# Altium schematic sheet Delay_latch_stage.SchDoc
size A4; SheetNumber: 4; SheetTotal: 5
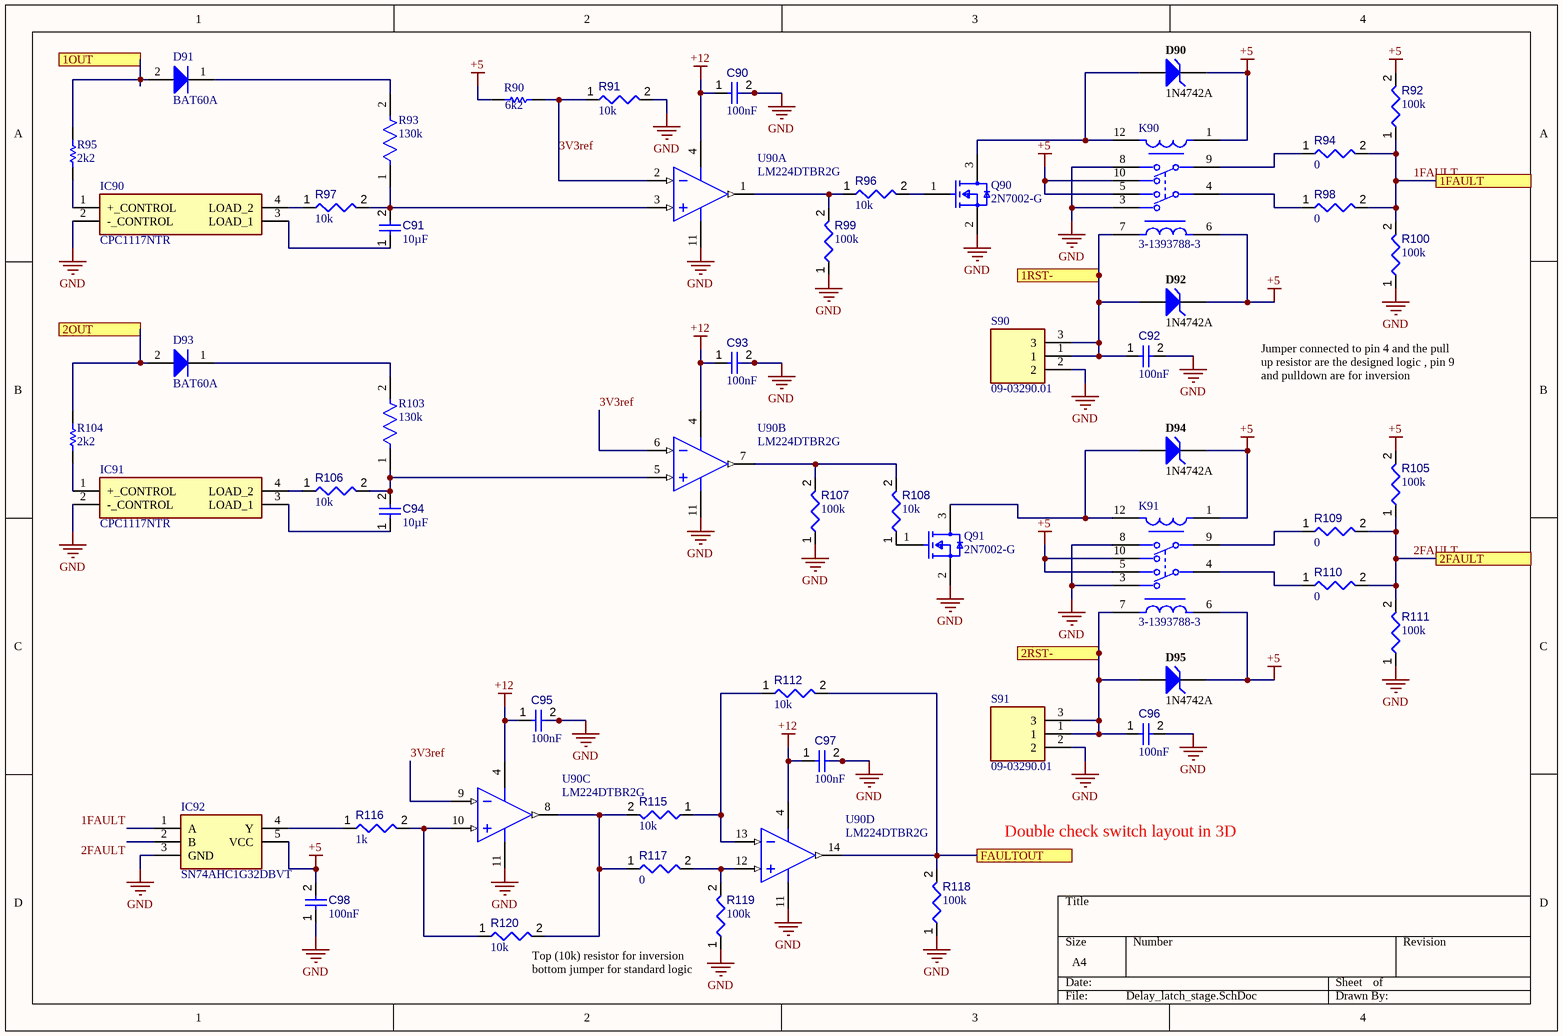
[diagram p0: Delay_latch_stage.SchDoc]

## Parts
C90  value 100nF  [CAPC1608X90X40NL10T20]  (hidden comment: Capacitor 100 nF +/-10% 50 V 0603)
C91  value 10µF  [CAPC0603(1608)100_L]  (hidden comment: Capacitor 10µF +/-20% 10V 0603)
C92  value 100nF  [CAPC1608X90X40NL10T20]  (hidden comment: Capacitor 100 nF +/-10% 50 V 0603)
C93  value 100nF  [CAPC1608X90X40NL10T20]  (hidden comment: Capacitor 100 nF +/-10% 50 V 0603)
C94  value 10µF  [CAPC0603(1608)100_L]  (hidden comment: Capacitor 10µF +/-20% 10V 0603)
C95  value 100nF  [CAPC1608X90X40NL10T20]  (hidden comment: Capacitor 100 nF +/-10% 50 V 0603)
C96  value 100nF  [CAPC1608X90X40NL10T20]  (hidden comment: Capacitor 100 nF +/-10% 50 V 0603)
C97  value 100nF  [CAPC1608X90X40NL10T20]  (hidden comment: Capacitor 100 nF +/-10% 50 V 0603)
C98  value 100nF  [CAPC1608X90X40NL10T20]  (hidden comment: Capacitor 100 nF +/-10% 50 V 0603)
D90  1N4742A  [FAIR-DO-41-2_V]
D91  BAT60A  [INF-SOD323_V]
D92  1N4742A  [FAIR-DO-41-2_V]
D93  BAT60A  [INF-SOD323_V]
D94  1N4742A  [FAIR-DO-41-2_V]
D95  1N4742A  [FAIR-DO-41-2_V]
IC90  CPC1117NTR  [SOP254P610X216-4N]
IC91  CPC1117NTR  [SOP254P610X216-4N]
IC92  SN74AHC1G32DBVT  [SOT95P280X145-5N]
K90  3-1393788-3  [FP-3-1393788-3-MFG]
K91  3-1393788-3  [FP-3-1393788-3-MFG]
Q90  2N7002-G  [FP-2N7002-G-IPC_C]
Q91  2N7002-G  [FP-2N7002-G-IPC_C]
R90  6k2  [RESC1609X50X30ML10T20]
R91  value 10k  [RESC1608X55X25ML10T15]  (hidden comment: Resistor 10k +/-1% 0603 100 mW)
R92  value 100k  [RESC1608X55X25ML10T15]  (hidden comment: Resistor 100k +/-1% 0603 100 mW)
R93  130k  [FP-CRCW0603-e3-IPC_C]
R94  value 0  [RESC0603(1608)_L]  (hidden comment: 0R3J)
R95  2k2  [RESC1608X55X25LL10T15]
R96  value 10k  [RESC1608X55X25ML10T15]  (hidden comment: Resistor 10k +/-1% 0603 100 mW)
R97  value 10k  [RESC1608X55X25ML10T15]  (hidden comment: Resistor 10k +/-1% 0603 100 mW)
R98  value 0  [RESC0603(1608)_L]  (hidden comment: 0R3J)
R99  value 100k  [RESC1608X55X25ML10T15]  (hidden comment: Resistor 100k +/-1% 0603 100 mW)
R100  value 100k  [RESC1608X55X25ML10T15]  (hidden comment: Resistor 100k +/-1% 0603 100 mW)
R103  130k  [FP-CRCW0603-e3-IPC_C]
R104  2k2  [RESC1608X55X25LL10T15]
R105  value 100k  [RESC1608X55X25ML10T15]  (hidden comment: Resistor 100k +/-1% 0603 100 mW)
R106  value 10k  [RESC1608X55X25ML10T15]  (hidden comment: Resistor 10k +/-1% 0603 100 mW)
R107  value 100k  [RESC1608X55X25ML10T15]  (hidden comment: Resistor 100k +/-1% 0603 100 mW)
R108  value 10k  [RESC1608X55X25ML10T15]  (hidden comment: Resistor 10k +/-1% 0603 100 mW)
R109  value 0  [RESC0603(1608)_L]  (hidden comment: 0R3J)
R110  value 0  [RESC0603(1608)_L]  (hidden comment: 0R3J)
R111  value 100k  [RESC1608X55X25ML10T15]  (hidden comment: Resistor 100k +/-1% 0603 100 mW)
R112  value 10k  [RESC1608X55X25ML10T15]  (hidden comment: Resistor 10k +/-1% 0603 100 mW)
R115  value 10k  [RESC1608X55X25ML10T15]  (hidden comment: Resistor 10k +/-1% 0603 100 mW)
R116  value 1k  [RESC1608X55X25ML10T15]  (hidden comment: Resistor 1k +/-1% 0603 100 mW)
R117  value 0  [RESC0603(1608)_L]  (hidden comment: 0R3J)
R118  value 100k  [RESC1608X55X25ML10T15]  (hidden comment: Resistor 100k +/-1% 0603 100 mW)
R119  value 100k  [RESC1608X55X25ML10T15]  (hidden comment: Resistor 100k +/-1% 0603 100 mW)
R120  value 10k  [RESC1608X55X25ML10T15]  (hidden comment: Resistor 10k +/-1% 0603 100 mW)
S90  09-03290.01  [09.03290.01]
S91  09-03290.01  [09.03290.01]
U90  LM224DTBR2G  [ONSC-TSSOP-14-948G-01_V]  (parts A,B,C,D of 4)

## Ports
1FAULT, 1OUT, 1RST-, 2FAULT, 2OUT, 2RST-, FAULTOUT

## Nets
+5: C98.2 D90.2(K) D92.2(K) D94.2(K) D95.2(K) IC92.5(VCC) K90.1(set+/reset-) K90.5 K90.6(reset+/set-) K90.10 K91.1(set+/reset-) K91.5 K91.6(reset+/set-) K91.10 R90.1 R92.2 R105.2
+12: C90.1 C93.1 C95.1 C97.1 U90.4(VCC)
GND: C90.2 C92.2 C93.2 C95.2 C96.2 C97.2 C98.1 IC90.2(-_CONTROL) IC91.2(-_CONTROL) IC92.3(GND) K90.3 K90.8 K91.3 K91.8 Q90.2(SOURCE) Q91.2(SOURCE) R91.2 R99.1 R100.1 R107.1 R111.1 R118.1 R119.1 S90.2 S91.2 U90.11(VEE/GND)
1FAULT: IC92.1(A) R92.1 R94.2 R98.2 R100.2 ; port 1FAULT
1OUT: D91.2(A) R95.2 ; port 1OUT
1RST-: C92.1 D92.1(A) K90.7(reset-/set+) S90.1 S90.3 ; port 1RST-
2FAULT: IC92.2(B) R105.1 R109.2 R110.2 R111.2 ; port 2FAULT
2OUT: D93.2(A) R104.2 ; port 2OUT
2RST-: C96.1 D95.1(A) K91.7(reset-/set+) S91.1 S91.3 ; port 2RST-
3V3ref: R90.2 R91.1 U90.2(IN1-) U90.6(IN2-) U90.9(IN3-)
FAULTOUT: R112.2 R118.2 U90.14(OUT4) ; port FAULTOUT
NetC91_1: C91.1 IC90.3(LOAD_1)
NetC91_2: C91.2 R93.1 R97.2 U90.3(IN1+)
NetC94_1: C94.1 IC91.3(LOAD_1)
NetC94_2: C94.2 R103.1 R106.2 U90.5(IN2+)
NetD90_1: D90.1(A) K90.12(set-/reset+) Q90.3(DRAIN)
NetD91_1: D91.1(K) R93.2
NetD93_1: D93.1(K) R103.2
NetD94_1: D94.1(A) K91.12(set-/reset+) Q91.3(DRAIN)
NetIC90_1: IC90.1(+_CONTROL) R95.1
NetIC90_4: IC90.4(LOAD_2) R97.1
NetIC91_1: IC91.1(+_CONTROL) R104.1
NetIC91_4: IC91.4(LOAD_2) R106.1
NetIC92_4: IC92.4(Y) R116.1
NetK90_4: K90.4 R98.1
NetK90_9: K90.9 R94.1
NetK91_4: K91.4 R110.1
NetK91_9: K91.9 R109.1
NetQ90_1: Q90.1(GATE) R96.2
NetQ91_1: Q91.1(GATE) R108.1
NetR96_1: R96.1 R99.2 U90.1(OUT1)
NetR107_2: R107.2 R108.2 U90.7(OUT2)
NetR112_1: R112.1 R115.1 U90.13(IN4-)
NetR115_2: R115.2 R117.1 R120.2 U90.8(OUT3)
NetR116_2: R116.2 R120.1 U90.10(IN3+)
NetR117_2: R117.2 R119.2 U90.12(IN4+)

## Notes on the sheet
- Jumper connected to pin 4 and the pull up resistor are the designed logic , pin 9 and pulldown are for inversion
- Double check switch layout in 3D
- (near R120) Top (10k) resistor for inversion bottom jumper for standard logic

## Library data of the parts
C90 C92 C93 C95-C98 = CMP-001-00017-6: Chip Capacitor, 100 nF, +/- 10%, 50 V, 0603 (1608 Metric); Voltage Rating: 50V; Capacitor Type: Ceramic; Tolerance: 10%; Mounting Technology: SM; Max Operating Temperature: 125°C; RoHS Compliant: True; Pins: 2; Case/Package: 0603; Min Operating Temperature: -55°C
C91 C94 = CMP-001-00075-4: Chip Capacitor, 10µF +/-20%, 10V, 0603, Thickness 1 mm; Tolerance: 10%; Voltage Rating: 10V; Max Operating Temperature: 85°C; Pins: 2; Case/Package: 0603; Mounting Technology: SMT; Min Operating Temperature: -55°C
D90 D92 D94 D95 = CMP-0892-00001-1: Zener Diode, 12V, 1W, 5%, -65 to 200 degC, 2-Pin DO-41, Body 2.72 x 5.2 mm, RoHS; Manufacturer: Fairchild Semiconductor; PD (W): 1; VZ (Min.) (V): 11.4; VZ (Max.) (V): 12.6; ZZ (Max) (ohm): 8; IR (uA): 5; Test Current IZ (mA): 21; PartNumber: 1N4742A; PackageVersion: Rev. 2; DatasheetVersion: Rev. H3; Mounting Technology: Through Hole; Tolerance: 5%; PackageDescription: 2-Pin Axial leaded, Body 2.72 x 5.2 mm, Lead Spread 25.4 mm; ComponentLink1Description: Manufacturer URL; ComponentLink3Description: Package Specification; ComponentLink2Description: Datasheet; ComponentLink2URL: http://www.fairchildsemi.com/ds/1N/1N4744A.pdf; PackageReference: DO-41-2; RoHS: TRUE; Operating and Storage Temperature Range: -65 to 200 degC; ComponentLink3URL: http://www.fairchildsemi.com/dwg/DO/DO41A.pdf; ComponentLink1URL: http://www.fairchildsemi.com/
D91 D93 = CMP-1183-00008-2: Silicon Schottky Diode, -55 to 85 degC, SOD323, Reel, Green; Manufacturer: Infineon; Green: TRUE; VR (max): 10Â V; IF (max): 3,000Â mA; VF (max): 370Â mV; CT (max): 35Â pF; Configuration: Single; PackageDescription: 3-Pin Small Outline Transistor Package, 1.25 x 2 mm Body, 0.65 mm Pitch; PartNumber: BAT60A; Mounting Technology: Surface Mount; PackageReference: SOT323; ComponentLink1Description: Manufacturer URL; Packing: Reel; ComponentLink3URL: http://www.infineon.com/dgdl/SOT323-Package_Overview.pdf?folderId=db3a30431936bc4b0119533e1dcb3c92&fileId=db3a30431936bc4b011953495f283cb1; ComponentLink2URL: http://www.infineon.com/dgdl/bat60aseries.pdf?folderId=db3a304313d846880113def5812204a1&fileId=db3a304313d846880113def70c9304a9; ComponentLink1URL: http://www.infineon.com/; ComponentLink2Description: Datasheet; ComponentLink3Description: Package Specification
IC90 IC91 = CPC1117NTR: Integrated Circuit; Manufacturer_Name: LITTELFUSE; Datasheet Link: https://componentsearchengine.com//CPC1117NTR.pdf; Height: 2.159mm; Mouser2 Part Number: 849-CPC1117NTR; Mouser2 Price/Stock: https://www.mouser.com/Search/Refine.aspx?Keyword=849-CPC1117NTR; Manufacturer_Part_Number: CPC1117NTR
IC92 = SN74AHC1G32DBVT: Integrated Circuit; Manufacturer_Name: Texas Instruments; Datasheet Link: http://www.ti.com/general/docs/lit/getliterature.tsp?genericPartNumber=sn74ahc1g32&fileType=pdf; Height: 1.45mm; Manufacturer_Part_Number: SN74AHC1G32DBVT; Mouser Part Number: 595-SN74AHC1G32DBVT; Mouser Price/Stock: https://www.mouser.co.uk/ProductDetail/Texas-Instruments/SN74AHC1G32DBVT?qs=fSCvMSq5ISVX4j%2FpWgAWfA%3D%3D; Arrow Part Number: SN74AHC1G32DBVT; Arrow Price/Stock: https://www.arrow.com/en/products/sn74ahc1g32dbvt/texas-instruments?region=nac
K90 K91 = CMP-03396-000001-1: RELAY GEN PURPOSE DPDT 2A 5VDC; Manufacturer: TE Connectivity; Switching Power: 60W; Coil Voltage: 5V; Coil Resistance: 178Ω; Switching Current: 5A; Coil Power: 140mW; Standoff Height: 0.4mm; Coil Type: Latching and Dual Coil; Number Of Contacts: 2; Mouser Description: Electromechanical Relay 5VDC 178Ohm 2A DPDT (14.5x7.2x9.8)mm THT Signal Relay; Package: 3-1393788-3; ComponentLink2URL: https://www.te.com/usa-en/product-3-1393788-3.html?te_bu=Cor&te_type=other&te_campaign=oct_glo_cor-oct-global-oth-prtnr-fy19-oct-octo-buy-bom_sma-298_2&elqCampaignId=35216; Height: 9.9mm; Lead Free: Yes; Ambient Temperature Range Low: -40°C; Octopart: https://octopart.com/3-1393788-3-te+connectivity-40665546; Manufacturer Part Number: 3-1393788-3; Throw Configuration: DPDT; Category: Relay; ComponentLink2Description: Datasheet; Ambient Temperature Range High: +85°C; Device Class L1: Electromechanical; Automotive: No; Current Rating: 2A; Digikey Description: RELAY GEN PURPOSE DPDT 2A 5VDC; RoHS: TRUE; Device Class L2: Relays; Device Class L3: Signal Relays
Q90 Q91 = CMP-06369-000003-1: MOSFET N-CH 60V 0.115A SOT23-3; Manufacturer: Microchip; Standoff Height: 0.01mm; Rthja Max: 203°C/W; Continuous Drain Current: 115mA; Depletion Mode: False; Typ Forward Diode Voltage: 1.2V; Number Of Channels: 1; Power Dissipation: 0.36W; Turn Off Delay Time: 20ns; Threshold Vgs Min: 1V; Threshold Vgs Max: 2.5V; Drain To Source Resistance: 7.5Ω; Input Capacitace At Vds: 50pF @ 25V; Reverse Recovery Time: 400ns; Pulse Drain Current: 800mA; Gate To Source Voltage: 30V; Manufacturer Part Number: 2N7002-G; Ambient Temperature Range Low: -55°C; Temperature Range Low: -55°C; ComponentLink2Description: Datasheet; Automotive: No; Temperature Range High: +150°C; Temperature: -55°C to +150°C; Ambient Temperature Range High: +150°C; ComponentLink2URL: http://ww1.microchip.com/downloads/en/DeviceDoc/2N7002-N-Channel-Enhancement-Mode-Vertical-DMOS-FET-Data-Sheet-20005797A.pdf; Octopart: https://octopart.com/2n7002-g-microchip-47153309; Mouser Description: Mosfet; N-channel Enhancement Mode; 60V; 7.5 OHM3 SOT-23T/R; Lead Free: Yes; Number Of N Channels: 1; Turn On Delay Time: 20ns; RoHS: TRUE; Digikey Description: MOSFET N-CH 60V 0.115A SOT23-3; Category: Trans; Ipc Land Pattern Name: SOT95P237X100-3; Height: 1.12mm; Device Class L2: Transistors; Drain To Source Breakdown Voltage: 60V; Device Class L1: Discrete Semiconductors; Drain To Source Voltage: 60V; Device Class L3: MOSFETs; Package: 2N7002-G
R90 = CMP-2000-03545-1: Part Number: CRCW06036K20FKEA; Manufacturer: Vishay Dale
R91 R96 R97 R106 R108 R112 R115 R120 = CMP-009-00017-5: Chip Resistor, 10 KOhm, +/- 1%, 01 W, -55 to 155 degC, 0603 (1608 Metric); Voltage Rating: 50V; Power: 100mW; RoHS Compliant: True; Min Operating Temperature: -55°C; Pins: 2; Case/Package: 0603; Mounting Technology: SM; Max Operating Temperature: 155°C; Tolerance: 1%
R92 R99 R100 R105 R107 R111 R118 R119 = CMP-009-00023-5: Chip Resistor, 100 KOhm, +/- 1%, 0.1 W, -55 to 155 degC, 0603 (1608 Metric); Voltage Rating: 50V; Power: 100mW; Max Operating Temperature: 155°C; RoHS Compliant: True; Tolerance: 1%; Pins: 2; Case/Package: 0603; Mounting Technology: SM; Min Operating Temperature: -55°C
R93 R103 = CMP-2000-03887-2: RES Thick Film, 130kΩ, 1%, 0.1W, 100ppm/°C, 0603; Resistance: 130kR; Power Rating: 100mW; Voltage Rating: 75V; Width: 0.033inch; Lead Free: Lead Free; Case Code (Imperial): 0603; Radiation Hardening: No; Termination: SMD/SMT; Tolerance: 1%; Packaging: Tape and Reel; Length: 1.55mm; Height: 0.45mm; Composition: Thick Film; Max Power Dissipation: 100mW; Max Operating Temperature: 155°C; Temperature Coefficient: 100ppm/°C; Voltage Rating (DC): 75V; Case Code (Metric): 1608; Case/Package: 0603; Military Standard: Not; Features: Automotive AEC-Q200; Number of Pins: 2; Weight: 7.1E-05oz; Min Operating Temperature: -55°C; Depth: 0.85mm; Number of Terminations: 2; Contact Plating: Tin; Package Quantity: 10
R94 R98 R109 R110 R117 = CMP-009-00063-2: Jumper 0603 (1608 Metric); Case/Package: 0603; Mounting Technology: SMT; Pins: 2
R95 R104 = CMP-2000-06934-1: Thick Film Resistor, 2.2 KOhm, 100 mW, 50 V, +/- 1%, -55 to 155 degC, 2-Pin SMD (0603), RoHS, Tape and Reel; Manufacturer: Yageo; Resistance: 2.2kOhms; Temperature Coefficient: 100PPM/C; Voltage Rating: 50V; Power Rating: 100mW; Tolerance: 1%; Datasheet Version: Rev. 7, 05/2017; Case Code - mm: 1608; Series: RC; Mounting Technology: SurfaceMount; Package Description: 2-Pin Surface Mount Device, Body 1.6 x 0.8 mm; Case Code - in: 0603; Package Reference: 0603; Product: ThickFilmResistorsGeneralPurpose; Manufacturer URL: http://www.yageo.com/; Termination Style: SMD/SMT; Operating Temperature Range: -55Cto+155C; Datasheet URL: http://www.yageo.com/documents/recent/PYu-RC_Group_51_RoHS_L_7.pdf; Packaging: Reel
R116 = CMP-009-00014-5: Chip Resistor, 1 KOhm, +/-1%, 0.1 W, -55 to 155 degC, 0603 (1608 Metric); Voltage Rating: 50V; Power: 100mW; Tolerance: 1%; Mounting Technology: SM; Pins: 2; Case/Package: 0603; Min Operating Temperature: -55°C; RoHS Compliant: True; Max Operating Temperature: 155°C
S90 S91 = 09-03290.01: Switch; Manufacturer_Name: EOZ; Manufacturer_Part_Number: 09-03290.01
U90 = CMP-1310-00430-1: Single Supply Quad Operational Amplifier, 3 to 32 V, -25 to 85 degC, 14-Pin TSSOP, Pb-Free, Tape and Reel; Manufacturer: On Semiconductor; VCC Min (V): 3; VCC Max (V): 32; Mounting Technology: Surface Mount; PackageVersion: Rev. B, 10/2006; DatasheetVersion: Rev. 25; RoHS: TRUE; ComponentLink3URL: http://www.onsemi.com/pub_link/Collateral/948G-01.PDF; ComponentLink3Description: Package Specification; PackageDescription: 14-Pin Small Outline Package, Body 5 x 4.4 mm, Pitch 0.65 mm; PackageReference: TSSOP-14-948G-01; ComponentLink1URL: http://www.onsemi.com/; Packing: Tape and Reel; ComponentLink2Description: Datasheet; PartNumber: LM224DTBR2G; ComponentLink2URL: http://www.onsemi.cn/pub_link/Collateral/LM324-D.PDF; ComponentLink1Description: Manufacturer URL